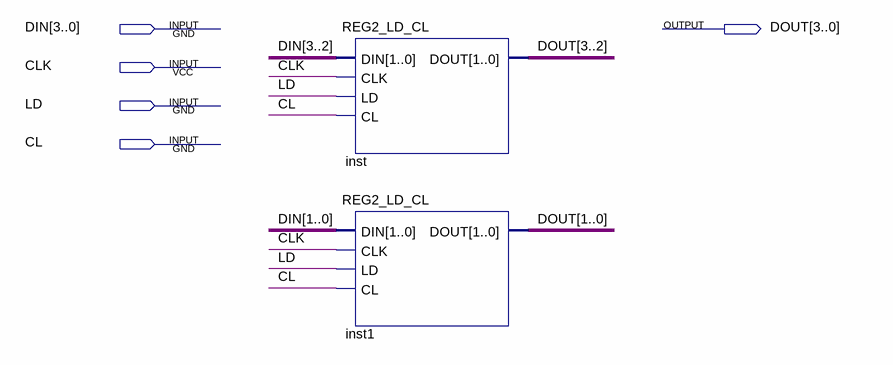
[diagram p0: schematic sheet]
// Quartus schematic REG4_LD_CL.bdf as structural Verilog: 2 symbols, 5 pins
module REG4_LD_CL (
  input  [3:0] DIN,
  input  CLK,
  input  LD,
  input  CL,
  output [3:0] DOUT
);

  REG2_LD_CL inst (.DIN(DIN[3:2]), .CLK(CLK), .LD(LD), .CL(CL), .DOUT(DOUT[3:2]));
  REG2_LD_CL inst1 (.DIN(DIN[1:0]), .CLK(CLK), .LD(LD), .CL(CL), .DOUT(DOUT[1:0]));
endmodule
